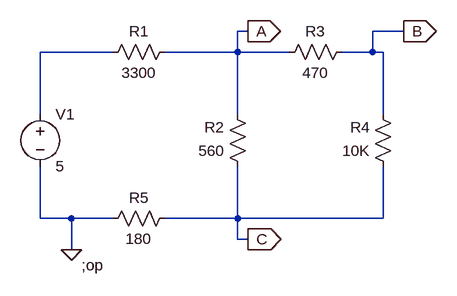
[diagram p0: schematic Practica 2-1.asc]
Practica 2-1.asc, the LTspice schematic file:
Version 4
SHEET 1 1100 784
WIRE 160 -16 144 -16
WIRE 400 -16 352 -16
WIRE -48 16 -160 16
WIRE 144 16 144 -16
WIRE 144 16 32 16
WIRE 224 16 144 16
WIRE 352 16 352 -16
WIRE 352 16 304 16
WIRE 368 16 352 16
WIRE -160 112 -160 16
WIRE 144 112 144 16
WIRE 368 112 368 16
WIRE -160 272 -160 192
WIRE -112 272 -160 272
WIRE -48 272 -112 272
WIRE 144 272 144 192
WIRE 144 272 32 272
WIRE 368 272 368 192
WIRE 368 272 144 272
WIRE 144 304 144 272
WIRE 160 304 144 304
WIRE -112 320 -112 272
FLAG -112 320 0
FLAG 160 -16 A
IOPIN 160 -16 Out
FLAG 400 -16 B
IOPIN 400 -16 Out
FLAG 160 304 C
IOPIN 160 304 Out
SYMBOL voltage -160 96 R0
WINDOW 123 0 0 Left 0
WINDOW 39 0 0 Left 0
SYMATTR InstName V1
SYMATTR Value 5
SYMBOL res 48 0 R90
WINDOW 0 0 56 VBottom 2
WINDOW 3 32 56 VTop 2
SYMATTR InstName R1
SYMATTR Value 3300
SYMBOL res 208 32 R270
WINDOW 0 32 56 VTop 2
WINDOW 3 0 56 VBottom 2
SYMATTR InstName R3
SYMATTR Value 470
SYMBOL res 160 208 R180
WINDOW 0 36 76 Left 2
WINDOW 3 36 40 Left 2
SYMATTR InstName R2
SYMATTR Value 560
SYMBOL res 384 208 R180
WINDOW 0 36 76 Left 2
WINDOW 3 36 40 Left 2
SYMATTR InstName R4
SYMATTR Value 10K
SYMATTR SpiceLine tol=1 pwr=0.1
SYMBOL res -64 288 R270
WINDOW 0 32 56 VTop 2
WINDOW 3 0 56 VBottom 2
SYMATTR InstName R5
SYMATTR Value 180
TEXT -96 344 Left 2 !;op

The netlist it stands for:
* Practica 2-1.asc
V1 N001 0 5
R1 A N001 3300
R3 A B 470
R2 C A 560
R4 C B 10K tol=1 pwr=0.1
R5 0 C 180
;op
.backanno
.end